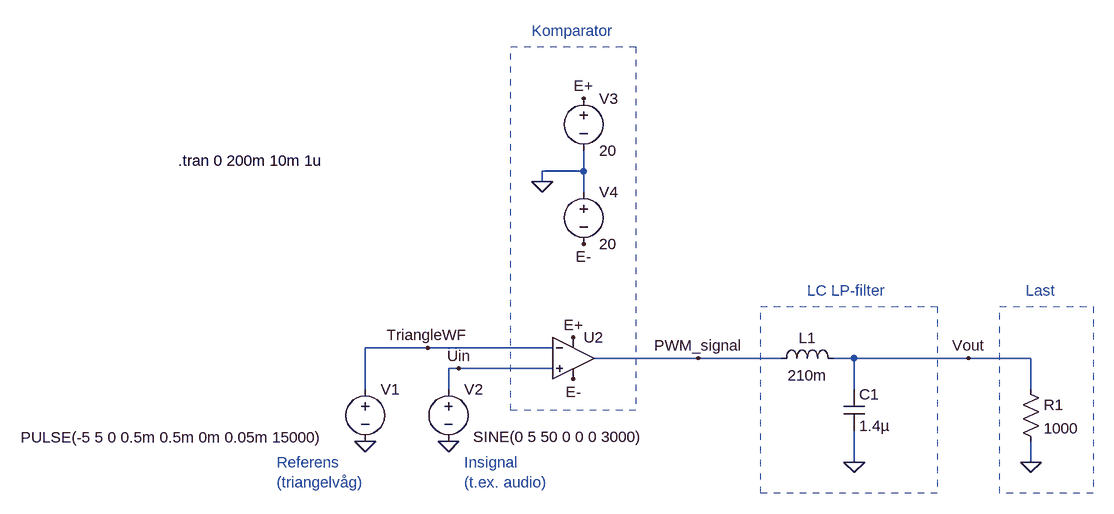
[diagram p0: schematic Class_D_amplifier.asc]
Class_D_amplifier.asc, the LTspice schematic file:
Version 4
SHEET 1 2072 696
WIRE 352 48 352 16
WIRE 352 48 288 48
WIRE 288 64 288 48
WIRE 352 80 352 48
WIRE 112 320 16 320
WIRE 304 320 112 320
WIRE 528 336 368 336
WIRE 656 336 528 336
WIRE 768 336 736 336
WIRE 944 336 768 336
WIRE 1040 336 944 336
WIRE 160 352 144 352
WIRE 304 352 160 352
WIRE 16 384 16 320
WIRE 144 384 144 352
WIRE 768 384 768 336
WIRE 1040 384 1040 336
WIRE 768 496 768 448
WIRE 1040 496 1040 464
FLAG 16 464 0
FLAG 112 320 TriangleWF
FLAG 144 464 0
FLAG 160 352 Uin
FLAG 528 336 PWM_signal
FLAG 352 -64 E+
FLAG 336 304 E+
FLAG 352 160 E-
FLAG 336 368 E-
FLAG 288 64 0
FLAG 944 336 Vout
FLAG 1040 496 0
FLAG 768 496 0
SYMBOL voltage 16 368 R0
WINDOW 3 -530 90 Left 2
WINDOW 123 0 0 Left 0
WINDOW 39 0 0 Left 0
SYMATTR Value PULSE(-5 5 0 0.5m 0.5m 0m 0.05m 15000)
SYMATTR InstName V1
SYMBOL voltage 144 368 R0
WINDOW 3 38 89 Left 2
WINDOW 123 0 0 Left 0
WINDOW 39 0 0 Left 0
SYMATTR Value SINE(0 5 50 0 0 0 3000)
SYMATTR InstName V2
SYMBOL OpAmps\\UniversalOpAmp2 336 336 R0
SYMATTR InstName U2
SYMBOL voltage 352 -80 R0
WINDOW 123 0 0 Left 0
WINDOW 39 0 0 Left 0
SYMATTR InstName V3
SYMATTR Value 20
SYMBOL voltage 352 64 R0
WINDOW 123 0 0 Left 0
WINDOW 39 0 0 Left 0
SYMATTR InstName V4
SYMATTR Value 20
SYMBOL ind 640 352 R270
WINDOW 0 32 56 VTop 2
WINDOW 3 5 56 VBottom 2
SYMATTR InstName L1
SYMATTR Value 210m
SYMBOL cap 752 384 R0
SYMATTR InstName C1
SYMATTR Value 1.4µ
SYMBOL res 1024 368 R0
SYMATTR InstName R1
SYMATTR Value 1000
TEXT -272 32 Left 2 !.tran 0 200m 10m 1u
TEXT 272 -168 Left 2 ;Komparator
TEXT -120 496 Left 2 ;Referens\n(triangelvåg)
TEXT 168 496 Left 2 ;Insignal\n(t.ex. audio)
TEXT 696 232 Left 2 ;LC LP-filter
TEXT 1032 232 Left 2 ;Last
RECTANGLE Normal 432 416 240 -144 1
RECTANGLE Normal 896 544 624 256 1
RECTANGLE Normal 1136 544 992 256 1

The netlist it stands for:
* Class_D_amplifier.asc
V1 TriangleWF 0 PULSE(-5 5 0 0.5m 0.5m 0m 0.05m 15000)
V2 Uin 0 SINE(0 5 50 0 0 0 3000)
XU2 Uin TriangleWF E+ E- PWM_signal level2 Avol=1Meg GBW=10Meg Slew=10Meg Ilimit=25m Rail=0 Vos=0 En=0 Enk=0 In=0 Ink=0 Rin=500Meg  ; pins In+ In- V+ V- OUT
V3 E+ 0 20
V4 0 E- 20
L1 PWM_signal Vout 210m
C1 Vout 0 1.4µ
R1 Vout 0 1000
.tran 0 200m 10m 1u
* Komparator
* Referens
* (triangelvåg)
* Insignal
* (t.ex. audio)
* LC LP-filter
* Last
.lib UniversalOpAmp2.lib
.backanno
.end

* Results of the author's LTspice run, read from the files saved beside the schematic
* Operating Point, zero values left out:
*   V(trianglewf) = -5 V
*   V(pwm_signal) = 19.72 V
*   V(e+) = 20 V
*   V(e-) = -20 V
*   V(vout) = 19.72 V
*   I(L1) = 19.72 mA
*   I(R1) = 19.72 mA
*   I(V1) = 10 nA
*   I(V3) = -19.73 mA
*   I(V4) = -4.409 µA
*   Ix(u2:2) = -10 nA
*   Ix(u2:3) = 19.73 mA
*   Ix(u2:4) = -4.409 µA
*   Ix(u2:5) = -19.72 mA
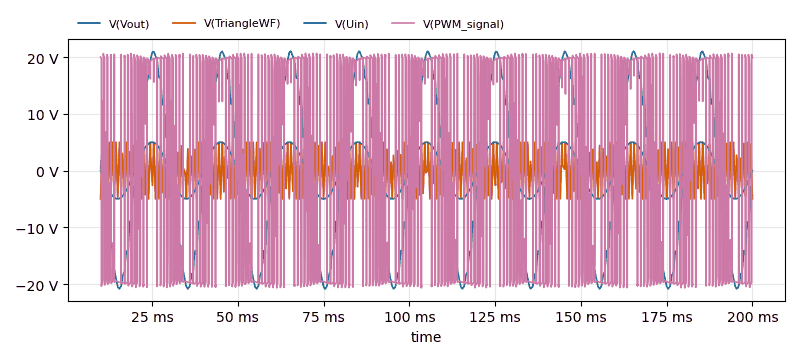
[diagram p1: Transient Analysis of Class_D_amplifier.asc, plotted from the saved traces]
* Transient Analysis, 1 run:
*   V(Vout): min -20.85 V, max 21.04 V, average -587.8 mV, rms 13.62 V, last -4.356 V
*   V(TriangleWF): min -5 V, max 5 V, average -7.461 µV, rms 2.983 V, last -5 V
*   V(Uin): min -5 V, max 5 V, average -167.5 mV, rms 3.535 V, last 0 V
*   V(PWM_signal): min -20.69 V, max 20.68 V, average -577.7 mV, rms 18.96 V, last 19.93 V